# Altium schematic sheet nrf52840.SchDoc
size A; SheetNumber: 1; SheetTotal: 3
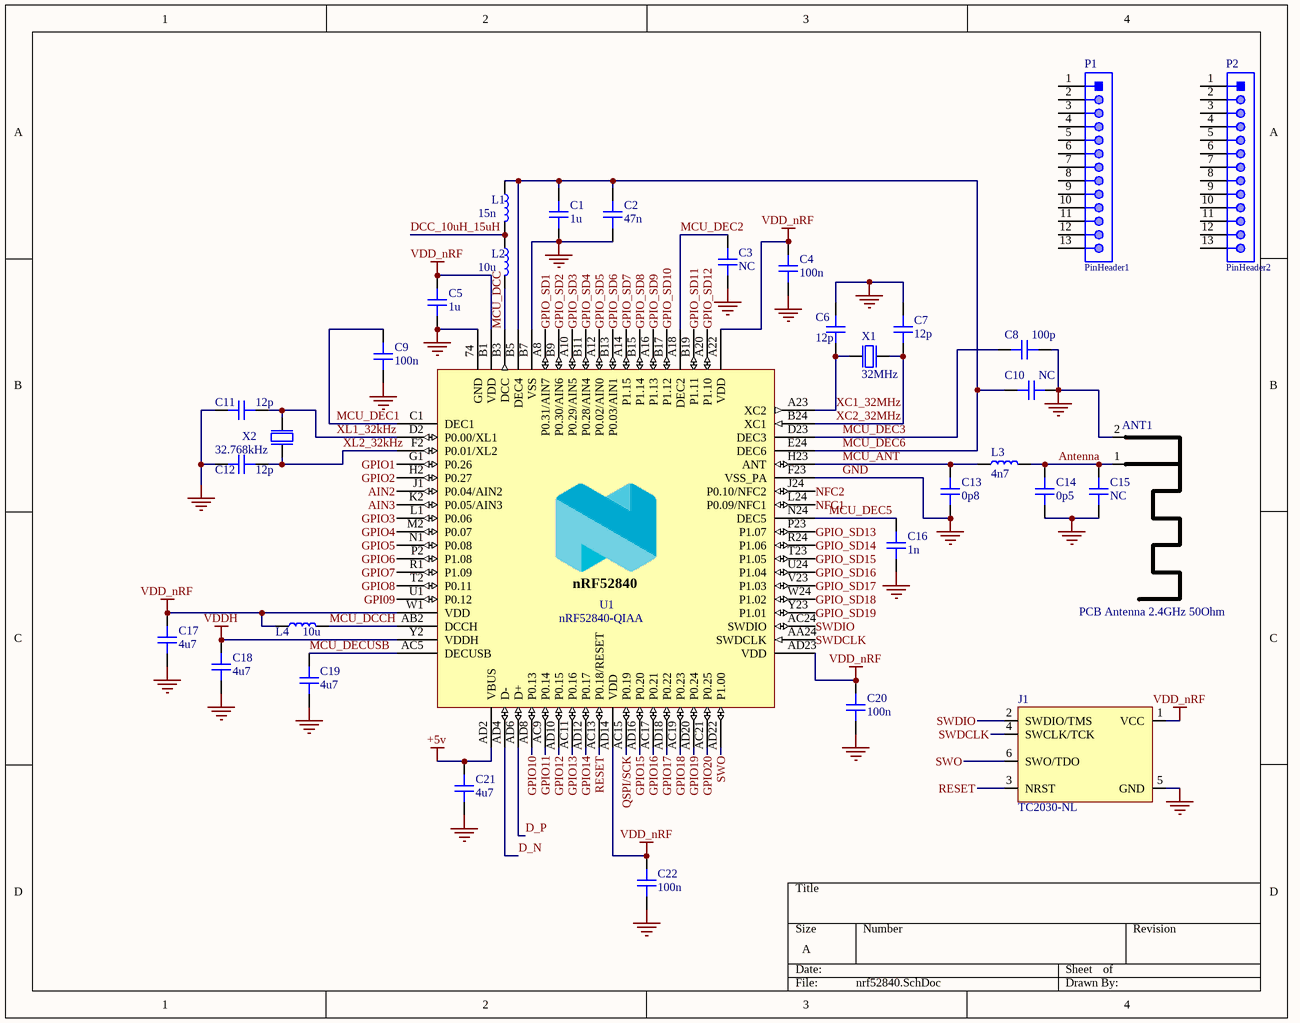
[diagram p0: nrf52840.SchDoc]

## Parts
ANT1  PCB Antenna 2.4GHz 50Ohm  [ANT_IFA_USB_2_4GHZ_50R]  (no BOM)
C1  1u  [CAP_0402]
C2  47n  [CAP_0402]
C3  NC  [CAP_0402]
C4  100n  [CAP_0402]
C5  1u  [CAP_0402]
C6  12p  [CAP_0402]
C7  12p  [CAP_0402]
C8  100p  [CAP_0402]
C9  100n  [CAP_0402]
C10  NC  [CAP_0402]
C11  12p  [CAP_0402]
C12  12p  [CAP_0402]
C13  0p8  [CAP_0402]
C14  0p5  [CAP_0402]
C15  NC  [CAP_0402]
C16  1n  [CAP_0402]
C17  4u7  [CAP_0603]
C18  4u7  [CAP_0603]
C19  4u7  [CAP_0603]
C20  100n  [CAP_0402]
C21  4u7  [CAP_0603]
C22  100n  [CAP_0402]
J1  TC2030-NL  [TC2030-NL-FP]  (no BOM)
L1  15n  [IND_0402]
L2  10u  [IND_0603]
L3  4n7  [IND_0402]
L4  10u  [IND_0603]
P1  PinHeader1  [61301311121]
P2  PinHeader2  [61301311121]
U1  nRF52840-QIAA  [AQFN50P700X700X85_HS-74N]
X1  32MHz  [BT-XTAL_2016]
X2  32.768kHz  [XTAL_3215]

## Nets
+5v: C21.2 U1.AD2(VBUS)
GND: ANT1.2(GND) C1.1 C2.1 C3.2 C4.1 C5.1 C6.2 C7.2 C8.1 C9.1 C10.1 C11.2 C12.2 C13.1 C14.1 C15.2 C16.1 C17.1 C18.1 C19.1 C20.1 C21.1 C22.1 J1.5(GND) U1.74(GND) U1.B7(VSS) U1.F23(VSS_PA) X1.2(GND) X1.4(GND)
VDD_nRF: C4.2 C5.2 C17.2 C20.2 C22.2 J1.1(VCC) L4.1 U1.A22(VDD) U1.AD14(VDD) U1.AD23(VDD) U1.B1(VDD) U1.W1(VDD)
VDDH: C18.2 U1.Y2(VDDH)
AIN2: U1.J1(P0.04/AIN2)
AIN3: U1.K2(P0.05/AIN3)
Antenna: ANT1.1(RF) C14.2 C15.1 L3.2
D_N: U1.AD4(D-)
D_P: U1.AD6(D+)
DCC_10uH_15uH: L1.2 L2.1
GPI09: U1.U1(P0.12)
GPIO1: U1.G1(P0.26)
GPIO2: U1.H2(P0.27)
GPIO3: U1.L1(P0.06)
GPIO4: U1.M2(P0.07)
GPIO5: U1.N1(P0.08)
GPIO6: U1.P2(P1.08)
GPIO7: U1.R1(P1.09)
GPIO8: U1.T2(P0.11)
GPIO10: U1.AD8(P0.13)
GPIO11: U1.AC9(P0.14)
GPIO12: U1.AD10(P0.15)
GPIO13: U1.AC11(P0.16)
GPIO14: U1.AD12(P0.17)
GPIO15: U1.AD16(P0.20)
GPIO16: U1.AC17(P0.21)
GPIO17: U1.AD18(P0.22)
GPIO18: U1.AC19(P0.23)
GPIO19: U1.AD20(P0.24)
GPIO20: U1.AC21(P0.25)
GPIO_SD1: U1.A8(P0.31/AIN7)
GPIO_SD2: U1.B9(P0.30/AIN6)
GPIO_SD3: U1.A10(P0.29/AIN5)
GPIO_SD4: U1.B11(P0.28/AIN4)
GPIO_SD5: U1.A12(P0.02/AIN0)
GPIO_SD6: U1.B13(P0.03/AIN1)
GPIO_SD7: U1.A14(P1.15)
GPIO_SD8: U1.B15(P1.14)
GPIO_SD9: U1.A16(P1.13)
GPIO_SD10: U1.B17(P1.12)
GPIO_SD11: U1.B19(P1.11)
GPIO_SD12: U1.A20(P1.10)
GPIO_SD13: U1.P23(P1.07)
GPIO_SD14: U1.R24(P1.06)
GPIO_SD15: U1.T23(P1.05)
GPIO_SD16: U1.U24(P1.04)
GPIO_SD17: U1.V23(P1.03)
GPIO_SD18: U1.W24(P1.02)
GPIO_SD19: U1.Y23(P1.01)
MCU_ANT: C13.2 L3.1 U1.H23(ANT)
MCU_DCC: L2.2 U1.B3(DCC)
MCU_DCCH: L4.2 U1.AB2(DCCH)
MCU_DEC1: C9.2 U1.C1(DEC1)
MCU_DEC2: C3.1 U1.A18(DEC2)
MCU_DEC3: C8.2 U1.D23(DEC3)
MCU_DEC5: C16.2 U1.N24(DEC5)
MCU_DEC6: C1.2 C2.2 C10.2 L1.1 U1.B5(DEC4) U1.E24(DEC6)
MCU_DECUSB: C19.2 U1.AC5(DECUSB)
NFC1: U1.L24(P0.09/NFC1)
NFC2: U1.J24(P0.10/NFC2)
QSPI/SCK: U1.AC15(P0.19)
RESET: J1.3(NRST) U1.AC13(P0.18/RESET)
SWDCLK: J1.4(SWCLK/TCK) U1.AA24(SWDCLK)
SWDIO: J1.2(SWDIO/TMS) U1.AC24(SWDIO)
SWO: J1.6(SWO/TDO) U1.AD22(P1.00)
XC1_32MHz: C6.1 U1.A23(XC2) X1.1(inp)
XC2_32MHz: C7.1 U1.B24(XC1) X1.3(out)
XL1_32kHz: C11.1 U1.D2(P0.00/XL1) X2.2(out)
XL2_32kHz: C12.1 U1.F2(P0.01/XL2) X2.1(inp)

Not connected (* = marked no-connect by the designer): P1 1 2 3 4 5 6 7 8 9 10 11 12 13; P2 1 2 3 4 5 6 7 8 9 10 11 12 13

## Notes on the sheet
- (in symbol nRF52840-QIAAF0) nRF52840

## Library data of the parts
ANT1 = ANT_IFA_USB_2_4GHZ_50R: Inverted F 2.4GHz ISM PCB Antenna 50 Ohm; ComponentLink1Description: Datasheet; ComponentLink1URL: https://www.ti.com/lit/an/swra117d/swra117d.pdf
C1 C5 = CAP_0402_25V: Capacitor SMD 0402 25V
C2 C3 C6-C8 C10-C16 = CAP_0402_50V: Capacitor SMD 0402 50V
C4 C9 C20 C22 = CAP_0402_16V: Capacitor SMD 0402 16V
C17-C19 C21 = CAP_0603_25V: Capacitor SMD 0603 25V
J1 = TC2030-NL: Tag-Connect No-Solder SWD Debug Connector (No Legs) DO NOT PLACE; Manufacturer: Tag-Connect; Manufacturer Part Number: TC2030-NL-FP
L1 L3 = IND_0402: Inductor SMD 0402
L2 L4 = IND_0603: Inductor SMD 0603
P1 P2 = CMP-1502-01089-1: THT Vertical Pin Header WR-PHD, Pitch 2.54 mm, Single Row, 13 pins; Manufacturer: Wurth Elektronik; Rated Current: 3A; Working Voltage: 250VAC; Contact Resistance: 20mOhm; Withstanding Voltage: 500VAC; Pin Number: 13; Pitch: 2.54mm; Gender: Male; Part Number: 61301311121; Packaging: Bag; Publisher: WurthElektronik; Row Number: Single; Mounting Technology: THT; Manufacturer URL: http://www.we-online.de; Operating Temperature: -40to105degC; Package Reference: 61301311121; Orientation: Vertical; Datasheet URL: https://katalog.we-online.de/em/datasheet/6130xx11121.pdf
U1 = nRF52840-QIAAF0: Multi-protocol Bluetooth Low Energy, IEEE 802.15.4, ANT and 2.4GHz proprietary system-on-chip; Manufacturer: Nordic Semiconductor; Note: N.A.; Pad Count: 73; Part Number: nRF52840-QIAAF0; Manufacturer Part Number: nRF52840-QIAAF0; LatestRevisionDate: 2021-03-24; Published: 2021-03-24; Value: nRF52840-QIAA; Artikkelnr Noca: N.A.; Footprint Doc: AQFN-73; Part number IPS: N.A.; ComponentLink1URL: N.A.; ComponentLink1Description: Datasheet; ComponentLink2URL: N.A.; ComponentLink2Description: Supplier link; HelpURL: N.A.; Supplier 1: Nordic Semiconductor; Supplier Part Number 1: nRF52840-QIAAF0; Supplier 2: N.A.; Supplier Part Number 2: N.A.; PartId: 102000222; Component Class: nRF_Devices; Author: hany; Part number Norautron: N.A.
X1 = XTAL_SMD2016_32MHz_8pF_Golledge: XTAL SMD 2016, 32MHz, Cl=8pF, Tol: ±10ppm, Stab: ±15ppm; Manufacturer Part Number: MP06003; Part number IPS: 00000001431; Part number Norautron: N.A.; Note: XTAL SMD 32.000MHz; Artikkelnr Noca: 22010050; Pad Count: 4; Part Number: XTAL_SMD2016_32MHz_8pF_Golledge; LatestRevisionDate: 2016-11-02; Pin Count: 4; Publisher: Nordic Semiconductor; Published: 2016-11-02; Value: 32MHz; Footprint Doc: XTAL_2016; Manufacturer: Golledge; ComponentLink1URL: N.A.; ComponentLink1Description: Datasheet; ComponentLink2URL: N.A.; ComponentLink2Description: Supplier link; HelpURL: \\hizz\pro\app9717\Datasheet\crystals\Golledge\mp06003.pdf; Supplier 1: Link Nordic; Supplier Part Number 1: N.A.; Supplier 2: N.A.; Supplier Part Number 2: N.A.; Author: rsk; Component Class: Oscillators; PartId: 101600041
X2 = XTAL_SMD3215_32.768kHz_9pF_NDK: XTAL SMD 3215, 32.768kHz, 9pF, ±20ppm; Manufacturer: NDK; Manufacturer Part Number: NX3215SA-32.768K-STD-MUA-9; Part number IPS: 00000005419; Part number Norautron: N.A.; Note: XTAL SMD 32.768kHz; Artikkelnr Noca: 22010049; Pad Count: 2; Part Number: XTAL_SMD3215_32.768kHz_9pF_NDK; LatestRevisionDate: 2017-10-23; Pin Count: 2; Publisher: Nordic Semiconductor; Published: 2017-10-23; Value: 32.768kHz; Footprint Doc: XTAL_3215; ComponentLink1URL: N.A.; ComponentLink1Description: Datasheet; ComponentLink2URL: N.A.; ComponentLink2Description: Supplier link; HelpURL: N.A.; Supplier 1: N.A.; Supplier Part Number 1: N.A.; Supplier 2: N.A.; Supplier Part Number 2: N.A.; Author: rsk; Component Class: Oscillators; PartId: 101600019